# Altium schematic sheet BlockController.SchDoc: <title>
size A3; Organization: Institut d'Automatisation Industrielle; SheetNumber: 8; SheetTotal: 8; SVN: OUI; CurrentTime: 6; CurrentDate: 5; DocumentFullPathAndName: 8; DocumentName: 9; ModifiedDate: 13; ProjectName: <projet>
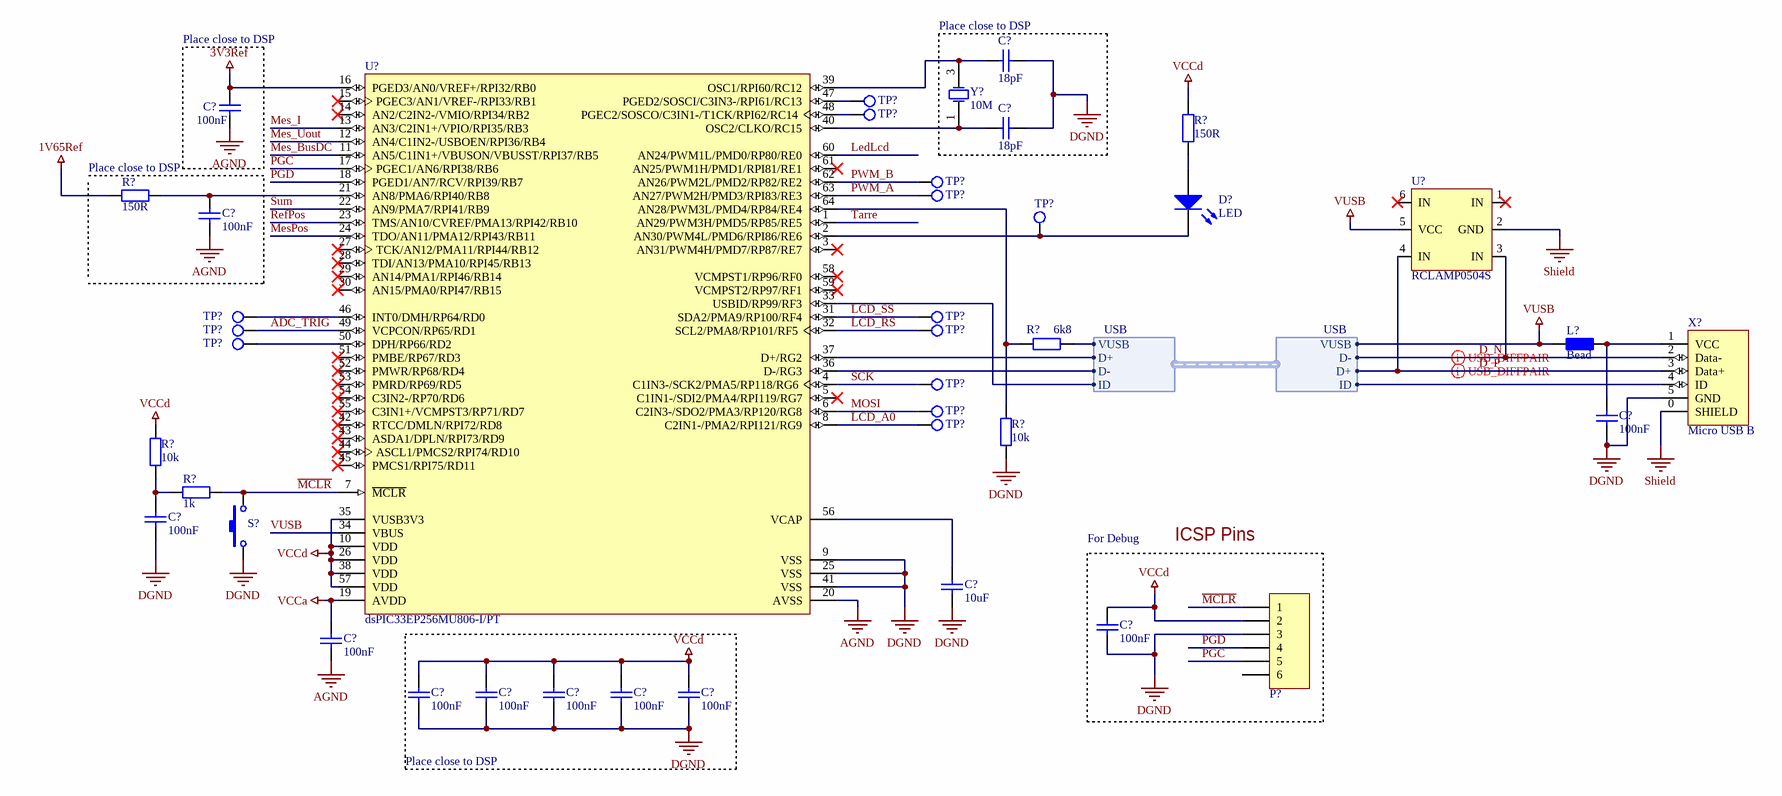
[diagram p0: BlockController.SchDoc]

## Parts
(Parts that share a designator on the sheet are numbered #1, #2 ... from top to bottom, then left to right.)
C?#1  18pF  [CAPC2012N]
C?#2  100nF  [CAPC2012N]
C?#3  18pF  [CAPC2012N]
C?#4  100nF  [CAPC2012N]
C?#5  100nF  [CAPC2012N]
C?#6  100nF  [CAPC2012N]
C?#7  10uF  [CAP1206]
C?#8  100nF  [CAPC2012N]
C?#9  100nF  [CAPC2012N]
C?#10  100nF  [CAPC2012N]
C?#11  100nF  [CAPC2012N]
C?#12  100nF  [CAPC2012N]
C?#13  100nF  [CAPC2012N]
C?#14  100nF  [CAPC2012N]
D?  LED  [LED2012N]
L?  Bead  [RESC2012N]
P?  Connector  [HEADER_6]  (value not drawn)
R?#1  150R  [RESC2012N]
R?#2  150R  [RESC2012N]
R?#3  6k8  [RESC2012N]
R?#4  10k  [RESC2012N]
R?#5  10k  [RESC2012N]
R?#6  1k  [RESC2012N]
S?  SW PTS810  [SW PTS810]  (value not drawn)
TP?#1  TP  [Testpoint]  (value not drawn)
TP?#2  TP  [Testpoint]  (value not drawn)
TP?#3  TP  [Testpoint]  (value not drawn)
TP?#4  TP  [Testpoint]  (value not drawn)
TP?#5  TP  [Testpoint]  (value not drawn)
TP?#6  TP  [Testpoint]  (value not drawn)
TP?#7  TP  [Testpoint]  (value not drawn)
TP?#8  TP  [Testpoint]  (value not drawn)
TP?#9  TP  [Testpoint]  (value not drawn)
TP?#10  TP  [Testpoint]  (value not drawn)
TP?#11  TP  [Testpoint]  (value not drawn)
TP?#12  TP  [Testpoint]  (value not drawn)
TP?#13  TP  [Testpoint]  (value not drawn)
U?#1  dsPIC33EP256MU806-I/PT  [TQFP64]
U?#2  RCLAMP0504S  [SOT-23-6]
X?  Micro USB B  [Micro_USB_ZX62-B-5PA(33)]
Y?  value 10M  [CRYSTAL_ABMM]  (hidden comment: XTAL)

## Blocks framed on the sheet
Place close to DSP: C?#1 C?#3 Y?
Place close to DSP: C?#2
ICSP Pins: C?#8 P?

## Harnesses
USB: VUSB, D-, D+, ID

## Nets
1V65Ref: R?#2.1
3V3Ref: C?#2.2 U?#1.16(PGED3/AN0/VREF+/RPI32/RB0)
AGND: C?#2.1 C?#4.1 C?#9.1 U?#1.20(AVSS)
DGND: C?#1.2 C?#3.2 C?#5.1 C?#6.1 C?#7.1 C?#8.1 C?#10.1 C?#11.1 C?#12.1 C?#13.1 C?#14.1 P?.3 R?#4.1 S?.1 U?#1.9(VSS) U?#1.25(VSS) U?#1.41(VSS) X?.5(GND)
Shield: U?#2.2(GND) X?.0(SHIELD)
VCCa: C?#9.2 U?#1.19(AVDD)
VCCd: C?#8.2 C?#10.2 C?#11.2 C?#12.2 C?#13.2 C?#14.2 P?.2 R?#1.2 R?#5.2 U?#1.10(VDD) U?#1.26(VDD) U?#1.35(VUSB3V3) U?#1.38(VDD) U?#1.57(VDD)
VUSB: L?.2 R?#3.2 U?#1.34(VBUS) U?#2.5(VCC) ; harness USB.VUSB
~{MCLR}: P?.1 R?#6.2 S?.3 U?#1.7(~{MCLR})
ADC_TRIG: TP?#8.1 U?#1.49(VCPCON/RP65/RD1)
D_N: U?#1.36(D-/RG3) U?#2.3(IN) X?.2(Data-) ; harness USB.D-
D_P: U?#1.37(D+/RG2) U?#2.4(IN) X?.3(Data+) ; harness USB.D+
LCD_A0: TP?#13.1 U?#1.8(C2IN1-/PMA2/RPI121/RG9)
LCD_RS: TP?#9.1 U?#1.32(SCL2/PMA8/RP101/RF5)
LCD_SS: TP?#7.1 U?#1.31(SDA2/PMA9/RP100/RF4)
LedLcd: U?#1.60(AN24/PWM1L/PMD0/RP80/RE0)
Mes_BusDC: U?#1.11(AN5/C1IN1+/VBUSON/VBUSST/RPI37/RB5)
Mes_I: U?#1.13(AN3/C2IN1+/VPIO/RPI35/RB3)
Mes_Uout: U?#1.12(AN4/C1IN2-/USBOEN/RPI36/RB4)
MesPos: U?#1.24(TDO/AN11/PMA12/RPI43/RB11)
MOSI: TP?#12.1 U?#1.6(C2IN3-/SDO2/PMA3/RP120/RG8)
PGC: P?.5 U?#1.17(PGEC1/AN6/RPI38/RB6)
PGD: P?.4 U?#1.18(PGED1/AN7/RCV/RPI39/RB7)
PWM_A: TP?#4.1 U?#1.63(AN27/PWM2H/PMD3/RPI83/RE3)
PWM_B: TP?#3.1 U?#1.62(AN26/PWM2L/PMD2/RP82/RE2)
RefPos: U?#1.23(TMS/AN10/CVREF/PMA13/RPI42/RB10)
SCK: TP?#11.1 U?#1.4(C1IN3-/SCK2/PMA5/RP118/RG6)
Sum: U?#1.22(AN9/PMA7/RPI41/RB9)
Tarre: U?#1.1(AN29/PWM3H/PMD5/RP85/RE5)
NetC?#1_1: C?#1.1 U?#1.39(OSC1/RPI60/RC12) Y?.3(OSC2)
NetC?#3_1: C?#3.1 U?#1.40(OSC2/CLKO/RC15) Y?.1(OSC1)
NetC?#4_2: C?#4.2 R?#2.2 U?#1.21(AN8/PMA6/RPI40/RB8)
NetC?#5_2: C?#5.2 L?.1 X?.1(VCC)
NetC?#6_2: C?#6.2 R?#5.1 R?#6.1
NetC?#7_2: C?#7.2 U?#1.56(VCAP)
NetD?_1: D?.1(A) R?#1.1
NetD?_2: D?.2(K) TP?#5.1 U?#1.2(AN30/PWM4L/PMD6/RPI86/RE6)
NetR?#3_1: R?#3.1 R?#4.2 U?#1.64(AN28/PWM3L/PMD4/RP84/RE4)
NetTP?#1_1: TP?#1.1 U?#1.47(PGED2/SOSCI/C3IN3-/RPI61/RC13)
NetTP?#2_1: TP?#2.1 U?#1.48(PGEC2/SOSCO/C3IN1-/T1CK/RPI62/RC14)
NetTP?#6_1: TP?#6.1 U?#1.46(INT0/DMH/RP64/RD0)
NetTP?#10_1: TP?#10.1 U?#1.50(DPH/RP66/RD2)
NetU?#1_33: U?#1.33(USBID/RP99/RF3) X?.4(ID) ; harness USB.ID

Not connected (* = marked no-connect by the designer): P? 6; U?#1 3(AN31/PWM4H/PMD7/RP87/RE7)* 5(C1IN1-/SDI2/PMA4/RPI119/RG7)* 14(AN2/C2IN2-/VMIO/RPI34/RB2)* 15(PGEC3/AN1/VREF-/RPI33/RB1)* 27(TCK/AN12/PMA11/RPI44/RB12)* 28(TDI/AN13/PMA10/RPI45/RB13)* 29(AN14/PMA1/RPI46/RB14)* 30(AN15/PMA0/RPI47/RB15)* 42(RTCC/DMLN/RPI72/RD8)* 43(ASDA1/DPLN/RPI73/RD9)* 44(ASCL1/PMCS2/RPI74/RD10)* 45(PMCS1/RPI75/RD11)* 51(PMBE/RP67/RD3)* 52(PMWR/RP68/RD4)* 53(PMRD/RP69/RD5)* 54(C3IN2-/RP70/RD6)* 55(C3IN1+/VCMPST3/RP71/RD7)* 58(VCMPST1/RP96/RF0)* 59(VCMPST2/RP97/RF1)* 61(AN25/PWM1H/PMD1/RPI81/RE1)*; U?#2 1(IN)* 6(IN)*

## Layout directives
differential pair: D_N, D_P

## Notes on the sheet
- (near R?#2) Place close to DSP
- For Debug
- Place close to DSP
- Title
- Institut d'automatisation industrielle
  rte de Cheseaux 1
  CH-1401 Yverdon-les-Bains
  T +41(0)24 55 77 377    F +41(0)24 55 76 320
  http://iai.heig-vd.ch       iai@heig-vd.ch
- Date:
- Size:
- A3
- Project:
- Sheet
- of
- No.
- Author:
- SVN
- Version
- File:

## Library data of the parts
C?#1 C?#3 = Cap_18pF: Capacitor; Value: 18pF; Supplier 1: Digi-Key; Supplier Part Number 1: 311-1102-1-ND
C?#2 C?#4-C?#6 C?#8-C?#14 = Cap_100nF: Capacitor; Value: 100nF; Supplier 1: Digi-Key; Supplier Part Number 1: 478-1395-1-ND
C?#7 = Cap_10uF: Capacitor; Value: 10uF; Supplier 1: Digi-Key; Supplier Part Number 1: 445-7886-1-ND
D? = Led_Rouge_0805: Supplier 1: Digi-Key; Supplier Part Number 1: 475-1415-1-ND
P? = Header 6: Header, 6-Pin; Supplier Part Number 1: S9015E-03-ND; Supplier 1: Digi-Key
R?#1 R?#2 = Res_150R: Resistor; Value: 150R; Supplier 1: Digi-Key; Supplier Part Number 1: 311-150CRCT-ND
R?#3 = Res_6k8: Resistor; Value: 6k8; Supplier 1: Digi-Key; Supplier Part Number 1: 311-6.80KCRCT-ND
R?#4 R?#5 = Res_10k: Resistor; Value: 10k; Supplier 1: Digi-Key; Supplier Part Number 1: 311-10.0KCRCT-ND
R?#6 = Res__1k: Resistor; Value: 1k; Supplier 1: Digi-Key; Supplier Part Number 1: 311-1.00KCRCT-ND
S? = SW PTS810: Switch; Supplier 1: Digi-Key; Supplier Part Number 1: CKN10502CT-ND
TP?#1-TP?#13 = TP: =Value; Supplier 1: Digi-Key; Supplier Part Number 1: 36-5006-ND
U?#1 = dsPIC33EP256MU806-I/PT: 16-Bit Digital Signal Processor; Supplier 1: Digi-Key; Supplier Part Number 1: DSPIC33EP256MU806-I/PT-ND; Value: DSPIC33EP256MU806-I/PT
U?#2 = RCLAMP0504S.TCT: Supplier 1: Digi-Key; Supplier Part Number 1: RCLAMP0504SCT-ND
X? = Micro_USB_ZX62-B-5PA(33): Supplier 1: Digi-Key; Supplier Part Number 1: H125270CT-ND
Y? = XTAL: Crystal Oscillator; Supplier 1: Digi-Key; Supplier Part Number 1: 535-9150-1-ND
L? = Bead: Value: Bead; Supplier 1: Digi-Key; Supplier Part Number 1: 240-2399-1-ND